# Altium schematic sheet rtc.SchDoc
size A3; DocumentNumber: 37; SheetNumber: 37; SheetTotal: 45; SheetDescription: Real Time Clock
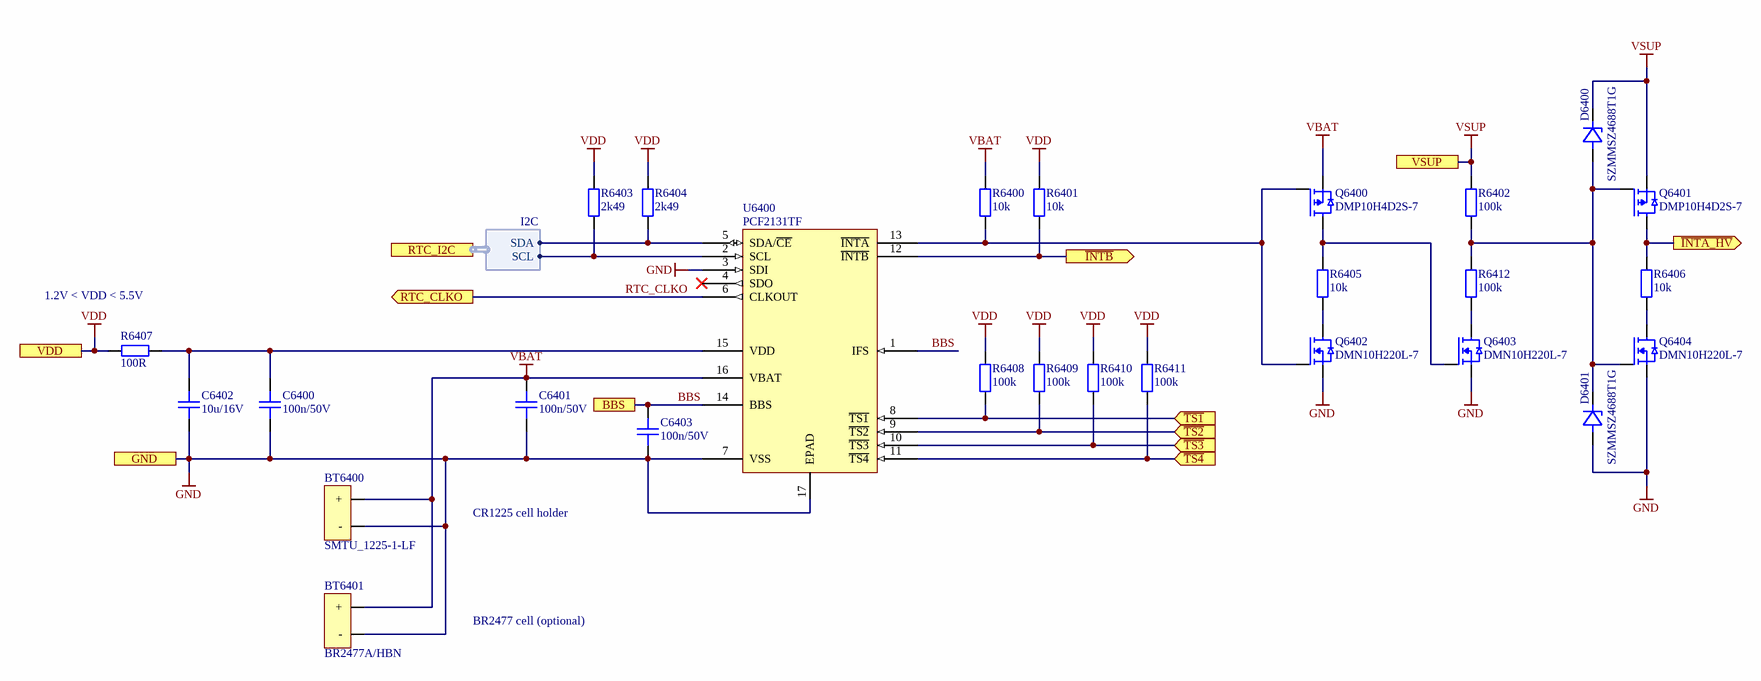
[diagram p0: rtc.SchDoc]

## Parts
BT6400  SMTU_1225-1-LF  [SMTU_1225-1-LF]
BT6401  BR2477A/HBN  [BR2477A-HBN]
C6400  100n/50V  [CAPC1005X06N]
C6401  100n/50V  [CAPC1005X06N]
C6402  10u/16V  [CAPC2012X14N]
C6403  100n/50V  [CAPC1005X06N]
D6400  SZMMSZ4688T1G  [SOD-123_CASE-425-04-ISSUE-G]
D6401  SZMMSZ4688T1G  [SOD-123_CASE-425-04-ISSUE-G]
Q6400  DMP10H4D2S-7  [SOT95P237X110-3N]
Q6401  DMP10H4D2S-7  [SOT95P237X110-3N]
Q6402  DMN10H220L-7  [SOT95P237X110-3N]
Q6403  DMN10H220L-7  [SOT95P237X110-3N]
Q6404  DMN10H220L-7  [SOT95P237X110-3N]
R6400  10k  [RESC1005X04N]
R6401  10k  [RESC1005X04N]
R6402  100k  [RESC1005X04N]
R6403  2k49  [RESC1005X04N]
R6404  2k49  [RESC1005X04N]
R6405  10k  [RESC1005X04N]
R6406  10k  [RESC1005X04N]
R6407  100R  [RESC1005X04N]
R6408  100k  [RESC1005X04N]
R6409  100k  [RESC1005X04N]
R6410  100k  [RESC1005X04N]
R6411  100k  [RESC1005X04N]
R6412  100k  [RESC1005X04N]
U6400  PCF2131TF  [NXP_SOT1992-1]

## Ports
BBS, GND, RTC_CLKO (out), RTC_I2C (harness I2C), VDD, VSUP, ~{INTA_HV} (out), ~{INTB} (out), ~{TS1} (in), ~{TS2} (in), ~{TS3} (in), ~{TS4} (in)

## Harnesses
I2C: SDA, SCL

## Nets
GND: BT6400.- BT6401.- C6400.1 C6401.1 C6402.1 C6403.1 D6401.2(A) Q6402.S Q6403.S Q6404.S U6400.3(SDI) U6400.7(VSS) U6400.17(EPAD) ; port GND
VBAT: BT6400.+ BT6401.+ C6401.2 Q6400.S R6400.2 U6400.16(VBAT)
VDD: R6401.2 R6403.2 R6404.2 R6407.2 R6408.2 R6409.2 R6410.2 R6411.2 ; port VDD
VSUP: D6400.1(K) Q6401.S R6402.2 ; port VSUP
~{INTA_HV}: Q6401.D R6406.2 ; port ~{INTA_HV}
~{INTB}: R6401.1 U6400.12(~{INTB}) ; port ~{INTB}
~{TS1}: R6408.1 U6400.8(~{TS1}) ; port ~{TS1}
~{TS2}: R6409.1 U6400.9(~{TS2}) ; port ~{TS2}
~{TS3}: R6410.1 U6400.10(~{TS3}) ; port ~{TS3}
~{TS4}: R6411.1 U6400.11(~{TS4}) ; port ~{TS4}
BBS: C6403.2 U6400.1(IFS) U6400.14(BBS) ; port BBS
RTC_CLKO: U6400.6(CLKOUT) ; port RTC_CLKO
NetC6400_2: C6400.2 C6402.2 R6407.1 U6400.15(VDD)
NetD6400_2: D6400.2(A) D6401.1(K) Q6401.G Q6404.G R6402.1 R6412.2
NetQ6400_D: Q6400.D Q6403.G R6405.2
NetQ6400_G: Q6400.G Q6402.G R6400.1 U6400.13(~{INTA})
NetQ6402_D: Q6402.D R6405.1
NetQ6403_D: Q6403.D R6412.1
NetQ6404_D: Q6404.D R6406.1
NetR6403_1: R6403.1 U6400.2(SCL) ; port RTC_I2C.SCL
NetR6404_1: R6404.1 U6400.5(SDA/~{CE}) ; port RTC_I2C.SDA

Not connected (* = marked no-connect by the designer): U6400 4(SDO)*

## Notes on the sheet
- (near R6407) 1.2V < VDD < 5.5V
- CR1225 cell holder
- BR2477 cell (optional)
- Fraunhofer IISB
- Schottkystr. 10
- developed by:
- 91058 Erlangen
- Germany
- Author
- Project
- License
- Description
- File
- Version
- Release Date
- Sheet
- foxbms.org <https://foxbms.org>
- www.iisb.fraunhofer.de <https://www.iisb.fraunhofer.de/>
- foxBMS Team
- /

## Library data of the parts
BT6400 = SMTU_1225-1-LF: SMTU 1225-1-LF, Battery Holder 1225; Manufacturer: Renata; Automotive Qualified: False; Part Number: SMTU_1225-1-LF; Part Name: SMTU_1225-1-LF; Operating Temperature: - / -40°C - +100°C; ComponentLink1Description: Datasheet; ComponentLink1URL: http://www.farnell.com/datasheets/1766152.pdf; Supplier 1: Farnell; Supplier Part Number 1: 1216353
BT6401 = BR2477A/HBN: Coin Cell Battery 3V 1000mAH HI TEMP; Manufacturer: Panasonic; Automotive Qualified: False; Part Number: BR2477A/HBN; Part Name: BR2477A/HBN; Operating Temperature: −40°C - +125°C; ComponentLink1Description: Datasheet; ComponentLink1URL: https://www.mouser.de/datasheet/2/315/panasonic-lithium-coin-hightemp-br2477a-datasheet-911159.pdf; Supplier 1: Digikey; Supplier Part Number 1: P029-ND; Supplier 2: Mouser; Supplier Part Number 2: 658-BR-2477A-HBN
C6400 C6401 C6403 = gen_C_ceramic_100n_50V_X7R_0402: MLCC; Capacitance: 100n; Rated Voltage: 50V; Dielectric: X7R; Case EIA: 0402; Case Metric: 1005; PnP Package: 0402C; PnP Value: 100nF/50V/X7R; PnP equipped: x; Automotive Qualified: True; AEC-Q Norm: AEC-Q200; Part Number: gen_C_ceramic_100n_50V_X7R_0402; Supplier 1: Farnell; Supplier Part Number 1: 2210822; ECCN: EAR99
C6402 = gen_C_ceramic_10u_16V_X7R_0805: MLCC; Capacitance: 10u; Rated Voltage: 16V; Dielectric: X7S; Case EIA: 0805; Case Metric: 2012; Automotive Qualified: True; AEC-Q Grade: Grade 1; AEC-Q Norm: AEC-Q200; Part Number: gen_C_ceramic_10u_16V_X7R_0805; ECCN: EAR99; Supplier 1: Digikey; Supplier Part Number 1: 445-16110-1-ND
D6400 D6401 = SZMMSZ4688T1G: Zener Diode; Manufacturer: ON Semiconductor; Breakdown Voltage: 4.7V; PnP Package: SOD123; Automotive Qualified: True; Part Number: SZMMSZ4688T1G; Part Name: SZMMSZ4688T1G; Operating Temperature: -55°C - +150°C; ComponentLink1Description: Datasheet; ComponentLink1URL: https://www.onsemi.com/pub/Collateral/MMSZ4678T1-D.PDF; Supplier 1: Digikey; Supplier Part Number 1: SZMMSZ4688T1GOSCT-ND; Supplier 2: Farnell; Supplier Part Number 2: 2774579; Supplier 3: Mouser; Supplier Part Number 3: 863-SZMMSZ4688T1G
Q6400 Q6401 = DMP10H4D2S-7: MOSFET-Transistor, p-Kanal, 0.27 A, 100 V, 4.2 ohm; Manufacturer: Diodes; Maximum Drain-Source Voltage: 100V; Maximum Continous Drain Current (25°C): 0.27A; R_DS(on): 4.2; Total Gate Charge: 1.8nC; Automotive Qualified: True; Part Number: DMP10H4D2S-7; Part Name: PMOS; Operating Temperature: -55°C - +150°C; ComponentLink1Description: Datasheet; ComponentLink1URL: https://www.diodes.com/assets/Datasheets/DMP10H4D2S.pdf; Supplier 1: Farnell; Supplier Part Number 1: 3127354; Supplier 2: Digikey; Supplier Part Number 2: DMP10H4D2S-7DICT-ND; Supplier 3: Mouser; Supplier Part Number 3: 621-DMP10H4D2S-7
Q6402-Q6404 = DMN10H220L-7: MOSFET-Transistor, n-Kanal, 1.6 A, 100 V, 0.250 ohm; Manufacturer: Diodes; Maximum Drain-Source Voltage: 100V; Maximum Continous Drain Current (25°C): 1.6A; R_DS(on): 250m; Total Gate Charge: 4.1nC; Automotive Qualified: True; Part Number: DMN10H220L-7; Part Name: NMOS; Operating Temperature: -55°C - +150°C; ComponentLink1Description: Datasheet; ComponentLink1URL: https://www.diodes.com/assets/Datasheets/DMN10H220L.pdf; Supplier 1: Digikey; Supplier Part Number 1: DMN10H220L-7DICT-ND; Supplier 2: Farnell; Supplier 3: Mouser; Supplier Part Number 2: 3127326; Supplier Part Number 3: 621-DMN10H220L-7
R6400 R6401 R6405 R6406 = gen_R_10k_0402: SMD Resistor 10k 0402; Tolerance: 1%; Power: 0.063W; Case EIA: 0402; Case Metric: 1005; Maximum Working Voltage: 50V; PnP Package: 0402R; PnP equipped: x; Automotive Qualified: True; AEC-Q Norm: AEC-Q200; Part Number: gen_R_10k_0402; Operating Temperature: -55°C - +155°C; Resistance: 10k; Series: E24, E96; PnP Value: 10k; Supplier 1: Farnell; Supplier Part Number 1: 2059239; ECCN: EAR99
R6402 R6408-R6412 = gen_R_100k_0402: SMD Resistor 100k 0402; Tolerance: 1%; Power: 0.063W; Case EIA: 0402; Case Metric: 1005; Maximum Working Voltage: 50V; PnP Package: 0402R; PnP equipped: x; Automotive Qualified: True; Part Number: gen_R_100k_0402; Operating Temperature: -55°C - +155°C; Resistance: 100k; Series: E24, E96; PnP Value: 100k; Supplier 1: Farnell; Supplier Part Number 1: 2302839
R6403 R6404 = gen_R_2k49_0402: SMD Resistor 2k49 0402; Tolerance: 1%; Power: 0.063W; Case EIA: 0402; Case Metric: 1005; Maximum Working Voltage: 50V; PnP Package: 0402R; Automotive Qualified: True; Part Number: gen_R_2k49_0402; Operating Temperature: -55°C - +155°C; Resistance: 2k49; Series: E96; PnP Value: 2k49; Supplier 1: Farnell; Supplier Part Number 1: 2059135
R6407 = gen_R_100R_0402: SMD Resistor 100R 0402; Tolerance: 1%; Power: 0.063W; Case EIA: 0402; Case Metric: 1005; Maximum Working Voltage: 50V; PnP Package: 0402R; PnP equipped: x; Automotive Qualified: True; AEC-Q Norm: AEC-Q200; Part Number: gen_R_100R_0402; Operating Temperature: -55°C - +155°C; Resistance: 100R; Series: E24, E96; PnP Value: 100R; Supplier 1: Farnell; Supplier Part Number 1: 2302528; ECCN: EAR99
U6400 = PCF2131TF: Ultra low power and high accurate RTC with integrated quartz crystal; Manufacturer: NXP; Automotive Qualified: True; AEC-Q Norm: AEC-Q100; Part Number: PCF2131TF; Part Name: PCF2131TF; Operating Temperature: −40°C - +85°C; ComponentLink1Description: Datasheet; ComponentLink1URL: https://www.nxp.com/docs/en/data-sheet/PCF2131DS.pdf